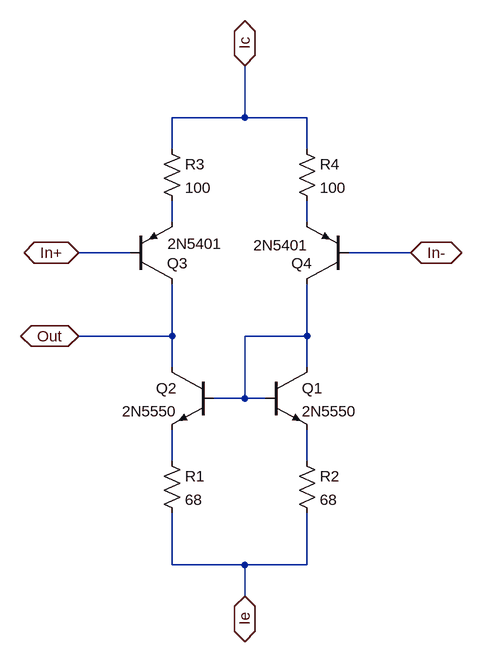
[diagram p0: schematic diff_pair.asc]
diff_pair.asc, the LTspice schematic file:
Version 4
SHEET 1 880 680
WIRE 192 -208 192 -288
WIRE 192 -208 80 -208
WIRE 288 -208 192 -208
WIRE 80 -160 80 -208
WIRE 288 -160 288 -208
WIRE 80 -48 80 -80
WIRE 288 -48 288 -80
WIRE 16 0 -64 0
WIRE 448 0 352 0
WIRE 80 128 80 48
WIRE 80 128 -64 128
WIRE 288 128 288 48
WIRE 288 128 192 128
WIRE 80 176 80 128
WIRE 288 176 288 128
WIRE 192 224 192 128
WIRE 192 224 144 224
WIRE 224 224 192 224
WIRE 80 320 80 272
WIRE 288 320 288 272
WIRE 80 480 80 400
WIRE 192 480 80 480
WIRE 288 480 288 400
WIRE 288 480 192 480
WIRE 192 528 192 480
FLAG -64 0 In+
IOPIN -64 0 BiDir
FLAG 448 0 In-
IOPIN 448 0 BiDir
FLAG -64 128 Out
IOPIN -64 128 BiDir
FLAG 192 -288 Ic
IOPIN 192 -288 BiDir
FLAG 192 528 Ie
IOPIN 192 528 BiDir
SYMBOL npn 224 176 R0
SYMATTR InstName Q1
SYMATTR Value 2N5550
SYMBOL npn 144 176 M0
SYMATTR InstName Q2
SYMATTR Value 2N5550
SYMBOL res 64 304 R0
SYMATTR InstName R1
SYMATTR Value 68
SYMBOL res 272 304 R0
SYMATTR InstName R2
SYMATTR Value 68
SYMBOL pnp 16 48 M180
WINDOW 3 57 62 Left 2
SYMATTR Value 2N5401
SYMATTR InstName Q3
SYMBOL pnp 352 48 R180
WINDOW 3 62 60 Left 2
SYMATTR Value 2N5401
SYMATTR InstName Q4
SYMBOL res 64 -176 R0
SYMATTR InstName R3
SYMATTR Value 100
SYMBOL res 272 -176 R0
SYMATTR InstName R4
SYMATTR Value 100

The netlist it stands for:
* diff_pair.asc
Q1 N003 N003 N005 0 2N5550
Q2 Out N003 N004 0 2N5550
R1 N004 Ie 68
R2 N005 Ie 68
Q3 Out In+ N001 0 2N5401
Q4 N003 In- N002 0 2N5401
R3 Ic N001 100
R4 Ic N002 100
.model NPN NPN
.model PNP PNP
.lib standard.bjt
.backanno
.end